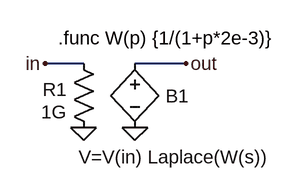
[diagram p0: schematic Lap.asc]
Lap.asc, the LTspice schematic file:
Version 4
SHEET 1 880 680
WIRE 96 144 48 144
WIRE 224 144 160 144
FLAG 160 224 0
FLAG 224 144 out
FLAG 48 144 in
FLAG 96 224 0
SYMBOL res 80 128 R0
WINDOW 0 -35 49 Left 0
WINDOW 3 -37 77 Left 0
SYMATTR InstName R1
SYMATTR Value 1G
SYMBOL bv 160 128 R0
WINDOW 0 39 57 Left 0
WINDOW 3 -70 133 Left 0
SYMATTR InstName B1
SYMATTR Value V=V(in) Laplace(W(s))
TEXT 64 112 Left 0 !.func W(p) {1/(1+p*2e-3)}

The netlist it stands for:
* Lap.asc
R1 in 0 1G
B1 out 0 V=V(in) Laplace(W(s))
.func W(p) {1/(1+p*2e-3)}
.backanno
.end